# EAGLE board ArduinoZeroV4.0 (EAGLE 9.5.1)
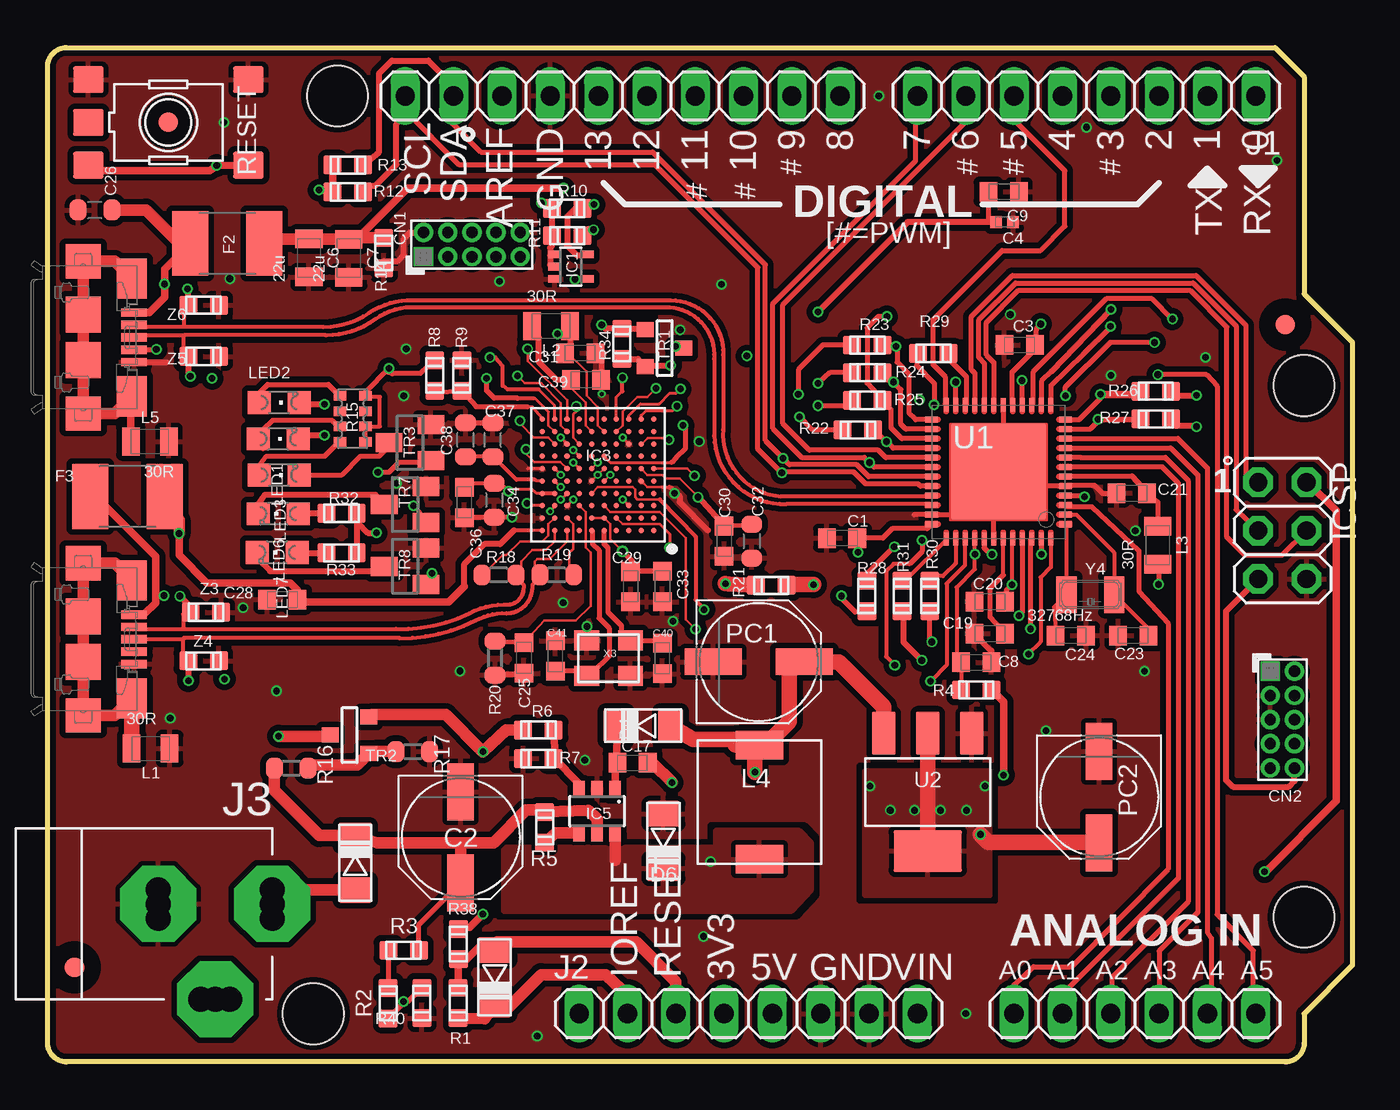
[diagram p3: board, top side]
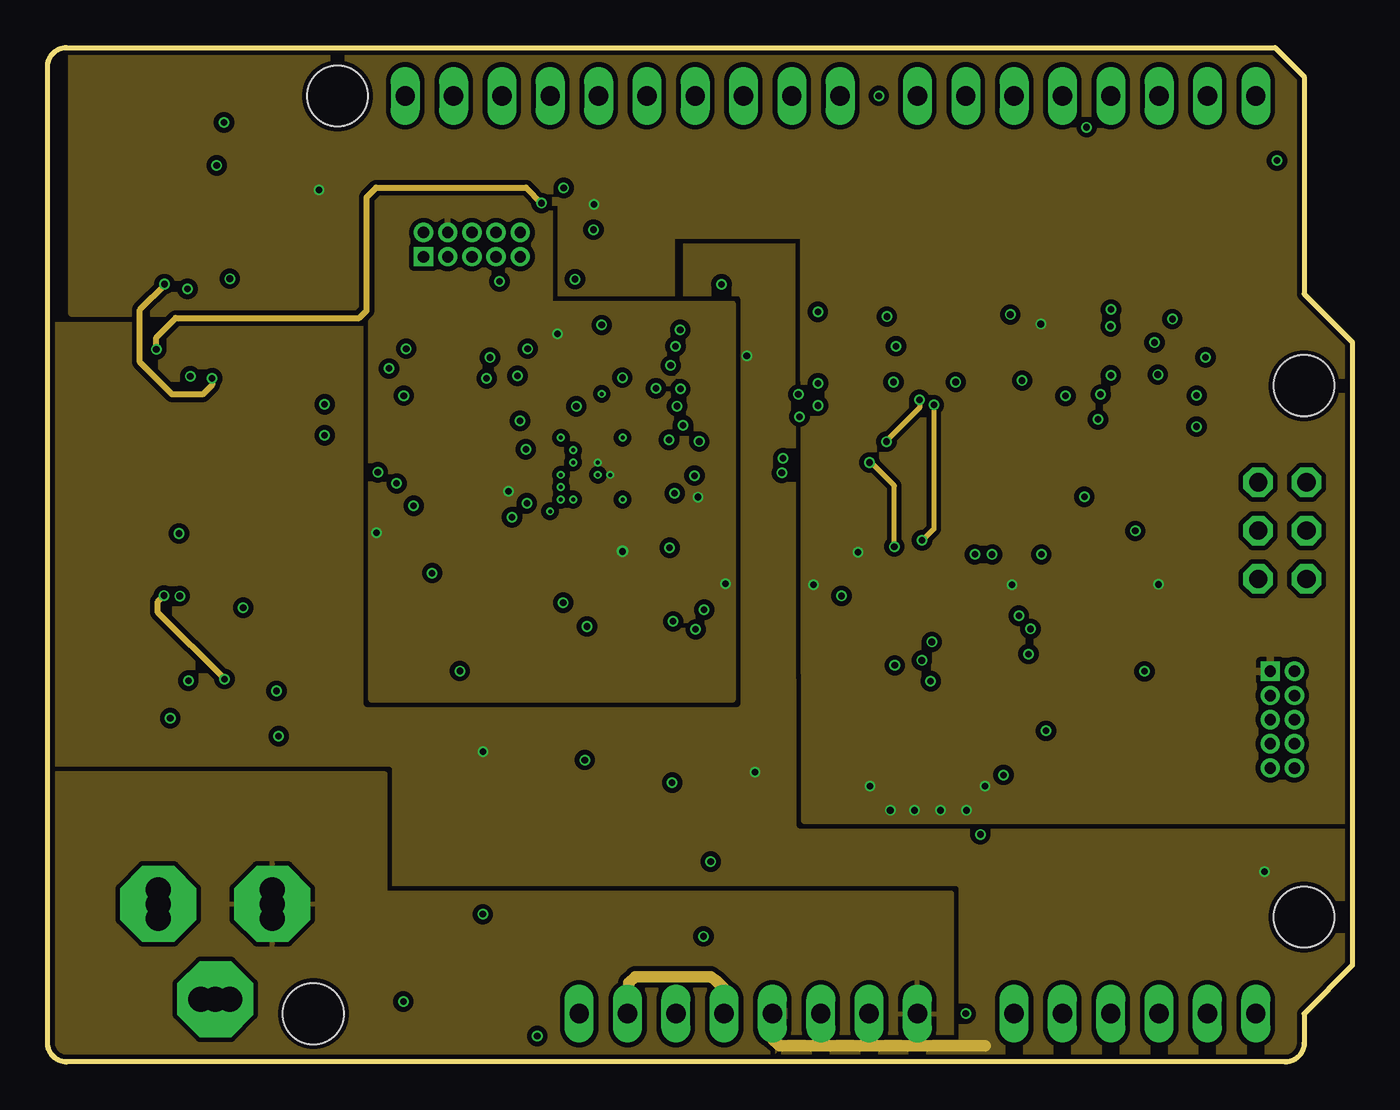
[diagram p4: board, inner layer Route2]
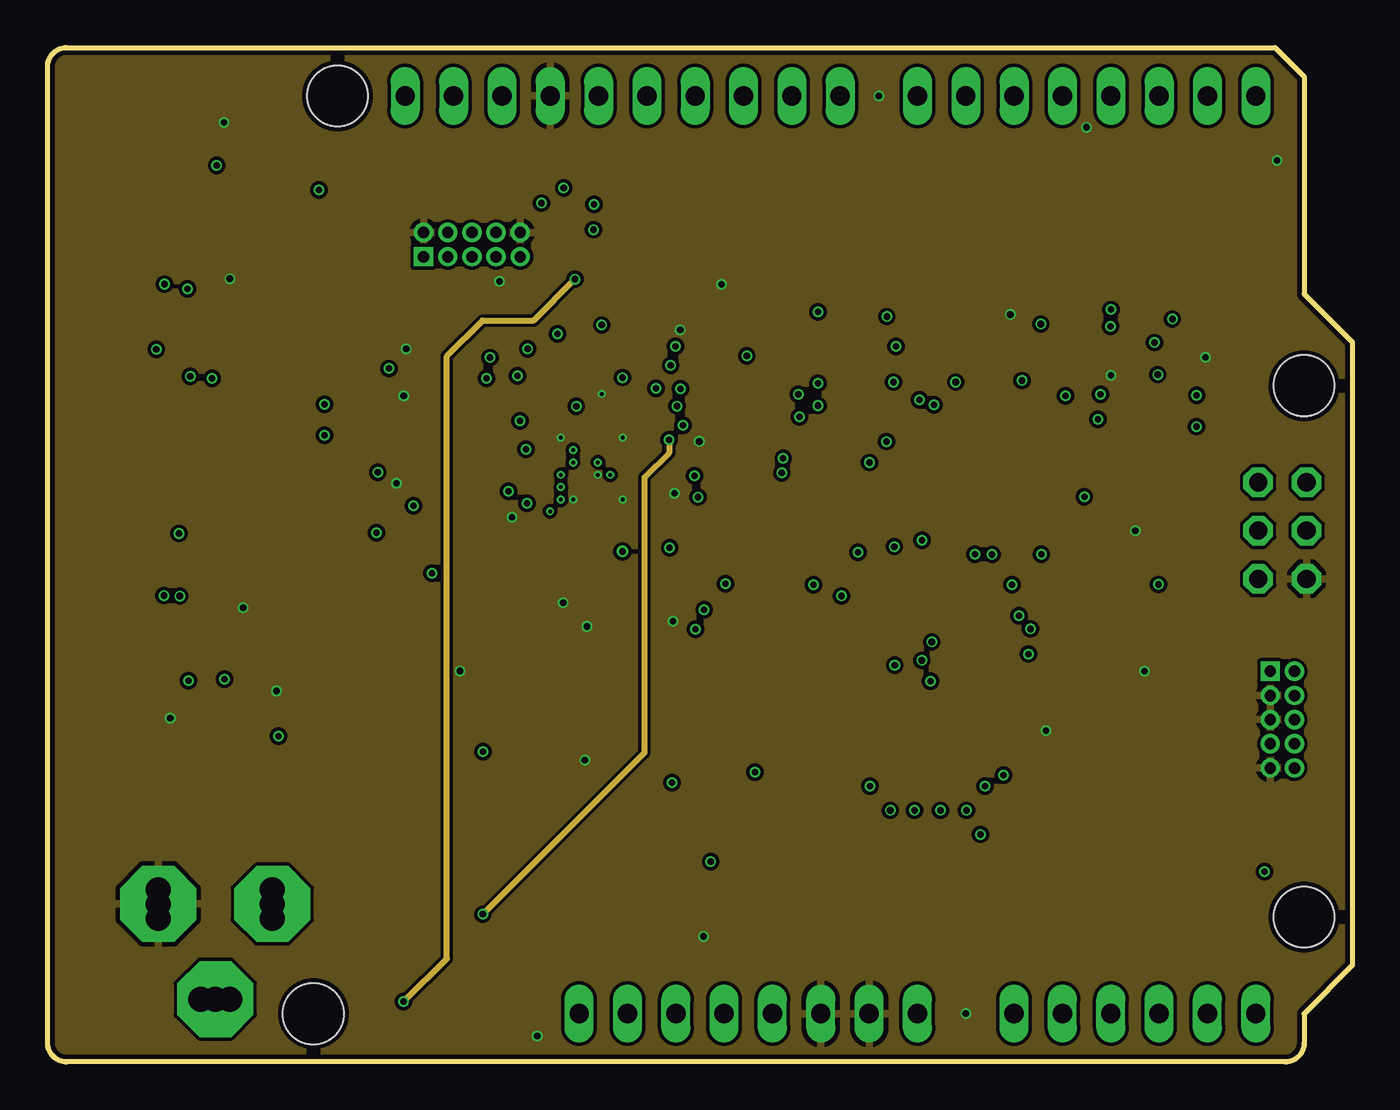
[diagram p5: board, inner layer Route15]
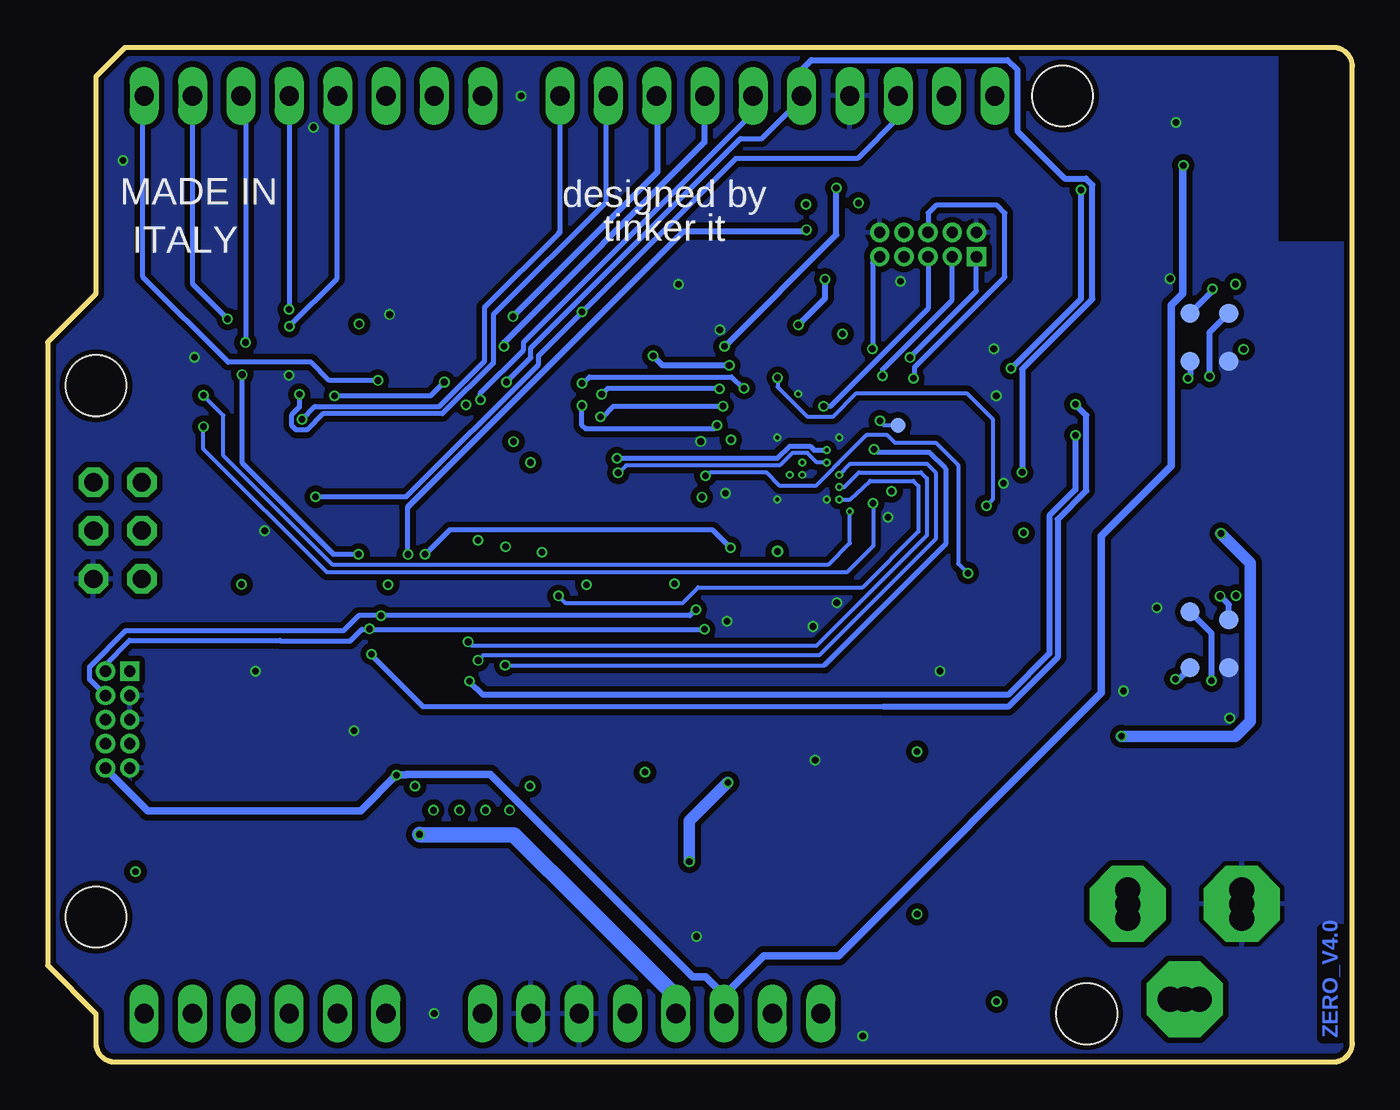
[diagram p6: board, bottom side, seen from below]

Size 68.58 x 53.34 mm. Coordinates in mm from the lower left corner, seen from the top.
Outline: 64.52,53.34 66.04,51.82 66.04,40.39 68.58,37.85 68.58,5.08 66.04,2.54 66.04,1 arc-90 65.04,0 1,0 arc-90 0,1 0,52.34 arc-90 1,53.34 64.52,53.34
Copper layers (1*2*15*16): Top 0.035mm / dielectric 0.2mm / Route2 0.0175mm / dielectric 0.3mm / Route15 0.0175mm / dielectric 0.2mm / Bottom 0.035mm
Design rules "B&B_4layers *": minimum track width 0.126mm, minimum drill 0.199mm, track to track 5mil, track to pad 5mil, pad to pad 3mil, via to via 3mil, smd to smd 0mil, copper to edge 10mil, drill to drill 8mil, minimum pad ring 6mil, minimum via ring 4mil, stop-mask expansion 4mil, vias tented up to drill 25mil, thermal gap 10mil
Net classes: 0 default: width 0.127 mm, drill 0.2 mm, clearance 0.076 mm; 1 USB: width 0.127 mm, drill 0.2 mm, clearance 0.178 mm; 2 gnd: width 0.127 mm, drill 0.2 mm, clearance 0.178 mm; 3 usbvcc: width 0.127 mm, drill 0.2 mm, clearance 0.178 mm; 4 USBpair: width 0.127 mm, drill 0.2 mm, clearance 0.076 mm to class 0
Holes 3.2 mm at 66.04,35.56 66.04,7.62 15.24,50.8 13.97,2.54

## Footprints (pad centres in the part's own frame; a part is rotated, then mirrored left to right if it is on the bottom)
TP-1.00MM = smd 1 x 1 bottom: X 0,0
0603-1608X90N = smd 0.95 x 1: 1 -0.8,0; 2 0.8,0
PANASONIC_D = smd 3 x 1.4: + 2.4,0; - -2.4,0
0402-1005X55N = smd 0.62 x 0.62: 1 -0.45,0; 2 0.45,0
0805-R2013X50N = smd 0.95 x 1.45: 1 -1,0; 2 1,0
C0603-ROUND = smd 0.898 x 1.1: 1 -0.889,0; 2 0.889,0
PINHEAD_2X05_127 = drill 0.6 pad 1.016 square: 1 -0.635,2.54 | drill 0.6 pad 1.016: 2 0.635,2.54; 3 -0.635,1.27; 4 0.635,1.27; 5 -0.635,0; 6 0.635,0; 7 -0.635,-1.27; 8 0.635,-1.27; 9 -0.635,-2.54; 10 0.635,-2.54
SOD123F = smd 1.34 x 1.8: A -1.43,0; C 1.43,0
L1812 = smd 1.9 x 3.4: 1 -1.95,0; 2 1.95,0
FD-1-1.5 = smd 1.016 x 1.016: P$1 0,0
SC70-5 = smd 0.4 x 0.7: 1 -0.65,-0.85; 2 0,-0.85; 3 0.65,-0.85; 4 0.65,0.85; 5 -0.65,0.85
VFBGA100 = smd 0.28 x 0.28: A1 -2.925,2.925; A2 -2.275,2.925; A3 -1.625,2.925; A4 -0.975,2.925; A5 -0.325,2.925; A6 0.325,2.925; A7 0.975,2.925; A8 1.625,2.925; A9 2.275,2.925; A10 2.925,2.925; B1 -2.925,2.275; B2 -2.275,2.275; B3 -1.625,2.275; B4 -0.975,2.275; B5 -0.325,2.275; B6 0.325,2.275; B7 0.975,2.275; B8 1.625,2.275; B9 2.275,2.275; B10 2.925,2.275; C1 -2.925,1.625; C2 -2.275,1.625; C3 -1.625,1.625; C4 -0.975,1.625; C5 -0.325,1.625; C6 0.325,1.625; C7 0.975,1.625; C8 1.625,1.625; C9 2.275,1.625; C10 2.925,1.625; D1 -2.925,0.975; D2 -2.275,0.975; D3 -1.625,0.975; D4 -0.975,0.975; D5 -0.325,0.975; D6 0.325,0.975; D7 0.975,0.975; D8 1.625,0.975; D9 2.275,0.975; D10 2.925,0.975; E1 -2.925,0.325; E2 -2.275,0.325; E3 -1.625,0.325; E4 -0.975,0.325; E5 -0.325,0.325; E6 0.325,0.325; E7 0.975,0.325; E8 1.625,0.325; E9 2.275,0.325; E10 2.925,0.325; F1 -2.925,-0.325; F2 -2.275,-0.325; F3 -1.625,-0.325; F4 -0.975,-0.325; F5 -0.325,-0.325; F6 0.325,-0.325; F7 0.975,-0.325; F8 1.625,-0.325; F9 2.275,-0.325; F10 2.925,-0.325; G1 -2.925,-0.975; G2 -2.275,-0.975; G3 -1.625,-0.975; G4 -0.975,-0.975; G5 -0.325,-0.975; G6 0.325,-0.975; G7 0.975,-0.975; G8 1.625,-0.975; G9 2.275,-0.975; G10 2.925,-0.975; H1 -2.925,-1.625; H2 -2.275,-1.625; H3 -1.625,-1.625; H4 -0.975,-1.625; H5 -0.325,-1.625; H6 0.325,-1.625; H7 0.975,-1.625; H8 1.625,-1.625; H9 2.275,-1.625; H10 2.925,-1.625; J1 -2.925,-2.275; J2 -2.275,-2.275; J3 -1.625,-2.275; J4 -0.975,-2.275; J5 -0.325,-2.275; J6 0.325,-2.275; J7 0.975,-2.275; J8 1.625,-2.275; J9 2.275,-2.275; J10 2.925,-2.275; K1 -2.925,-2.925; K2 -2.275,-2.925; K3 -1.625,-2.925; K4 -0.975,-2.925; K5 -0.325,-2.925; K6 0.325,-2.925; K7 0.975,-2.925; K8 1.625,-2.925; K9 2.275,-2.925; K10 2.925,-2.925
SOT23-6 = smd 0.6 x 0.9: 1 -0.95,-1.15; 2 0,-1.15; 3 0.95,-1.15; 4 0.95,1.15; 5 0,1.15; 6 -0.95,1.15
2X03 = drill 0.95 pad 1.55 octagon: 1 2.54,1.27; 2 2.54,-1.27; 3 0,1.27; 4 0,-1.27; 5 -2.54,1.27; 6 -2.54,-1.27
1X18-CUSTOM = drill 1.016 pad 1.27 long: 1 -17.78,0; 2 -15.24,0; 3 -12.7,0; 4 -10.16,0; 5 -7.62,0; 6 -5.08,0; 7 -2.54,0; 8 0,0; 9 4.064,0; 10 6.604,0; 11 9.144,0; 12 11.684,0; 13 14.224,0; 14 16.764,0; 15 19.304,0; 16 21.844,0; 17 24.384,0; 18 26.924,0
1X14-CUSTOM = drill 1.016 pad 1.27 long: 1 -17.78,0; 2 -15.24,0; 3 -12.7,0; 4 -10.16,0; 5 -7.62,0; 6 -5.08,0; 7 -2.54,0; 8 0,0; 9 5.08,0; 10 7.62,0; 11 10.16,0; 12 12.7,0; 13 15.24,0; 14 17.78,0
POWERSUPPLY_DC-21MM = drill 1.3 pad 4 octagon: +1 -0.076,-6.35; -1 -0.076,-0.356; E1 -5.08,-3.353 | drill 1.3: +2 -0.838,-6.35; +3 0.686,-6.35; -2 -0.838,-0.356; -3 0.686,-0.356; E2 -5.08,-2.591; E3 -5.08,-4.115
ZX62-AB-5PA = smd 0.4 x 1.35: 1 -1.3,3.025; 2 -0.65,3.025; 3 0,3.025; 4 0.65,3.025; 5 1.3,3.025 | smd 2.1 x 1.6: 6 3.1,2.9; 11 -3.1,2.9 | smd 1.8 x 1.9: 7 4,0.35; 10 -4,0.35 | smd 1.9 x 1.9: 8 1.2,0.35; 9 -1.2,0.35
SRR0604 = smd 1.5 x 2.5: P$1 3,0; P$2 -3,0
CHIPLED_0805 = smd 1.2 x 1.2: A -1.05,0; C 1.05,0
C0603 = smd 0.95 x 1: 1 -0.8,0; 2 0.8,0
CAY16 = smd 0.5 x 0.65: 1 -1.2,-0.675; 2 -0.4,-0.675; 3 0.4,-0.675; 4 1.2,-0.675; 5 1.2,0.675; 6 0.4,0.675; 7 -0.4,0.675; 8 -1.2,0.675
R0603-ROUND = smd 0.898 x 1.1: 1 -0.889,0; 2 0.889,0
TS42 = smd 1.6 x 1.4: 1 4.2,-2.25; 2 -4.2,-2.25; 3 4.2,2.25; 4 -4.2,2.25; 5 4.2,0
TP-SP = smd 0.8 x 0.8 bottom: X 0,0
SOT-23 = smd 0.787 x 0.889: 1 -0.025,1.016; 2 0.94,-1.016; 3 -0.991,-1.016
SOT23 = smd 1 x 1.4: 1 -0.95,-1.1; 2 0.95,-1.1; 3 0,1.1
QFN50P700X700X90-49XN-EPSQ515 = smd 0.65 x 0.28: 1 -3.525,2.75; 2 -3.525,2.25; 3 -3.525,1.75; 4 -3.525,1.25; 5 -3.525,0.75; 6 -3.525,0.25; 7 -3.525,-0.25; 8 -3.525,-0.75; 9 -3.525,-1.25; 10 -3.525,-1.75; 11 -3.525,-2.25; 12 -3.525,-2.75; 25 3.525,-2.75; 26 3.525,-2.25; 27 3.525,-1.75; 28 3.525,-1.25; 29 3.525,-0.75; 30 3.525,-0.25; 31 3.525,0.25; 32 3.525,0.75; 33 3.525,1.25; 34 3.525,1.75; 35 3.525,2.25; 36 3.525,2.75 | smd 0.28 x 0.65: 13 -2.75,-3.525; 14 -2.25,-3.525; 15 -1.75,-3.525; 16 -1.25,-3.525; 17 -0.75,-3.525; 18 -0.25,-3.525; 19 0.25,-3.525; 20 0.75,-3.525; 21 1.25,-3.525; 22 1.75,-3.525; 23 2.25,-3.525; 24 2.75,-3.525; 37 2.75,3.525; 38 2.25,3.525; 39 1.75,3.525; 40 1.25,3.525; 41 0.75,3.525; 42 0.25,3.525; 43 -0.25,3.525; 44 -0.75,3.525; 45 -1.25,3.525; 46 -1.75,3.525; 47 -2.25,3.525; 48 -2.75,3.525 | smd 5 x 5: 49 0,0
SOT223 = smd 2.235 x 1.219: 1 -3.099,2.311; 2 -3.099,0; 3 -3.099,-2.311 | smd 2.2 x 3.6: 4 3.099,0
CRYSTAL-3.2-2.5 = smd 1.3 x 1.05: 1 -1.15,-0.925; 2 1.15,-0.925; 3 1.15,0.925; 4 -1.15,0.925
ABS07 = smd 1.1 x 1.9: 1 -1.25,0; 2 1.25,0

## Placement (x,y rotation side)
BD+  DNP  [TP-1.00MM]  8.53,23.66 0 top
BD-  DNP  [TP-1.00MM]  6.5,23.27 0 top
C1  100n  [0603-1608X90N]  41.76,27.55 180 top
C2  47u  [PANASONIC_D]  21.71,11.81 270 top
C3  100n  [0603-1608X90N]  51.09,37.7 0 top
C4  100n  [0402-1005X55N]  50.3,44.16 0 top
C6  22u  [0805-R2013X50N]  13.74,42.27 270 top
C7  22u  [0805-R2013X50N]  15.83,42.26 270 top
C8  10n  [0603-1608X90N]  48.81,21.01 0 top
C9  4u7  [0603-1608X90N]  50.25,45.76 180 top
C17  10n  [0603-1608X90N]  30.74,15.73 0 top
C19  100n  [0603-1608X90N]  49.51,22.52 180 top
C20  100n  [0603-1608X90N]  49.51,24.2 180 top
C21  100n  [0603-1608X90N]  56.99,29.91 180 top
C23  22p  [0603-1608X90N]  57.07,22.42 0 top
C24  22p  [0603-1608X90N]  53.78,22.42 180 top
C25  10p  [0603-1608X90N]  25.04,21.23 270 top
C26  10n  [C0603-ROUND]  2.49,44.8 180 top
C28  100n  [0603-1608X90N]  12.33,24.31 180 top
C29  100n  [0603-1608X90N]  30.65,24.99 270 top
C30  100n  [0603-1608X90N]  35.56,27.38 270 top
C31  100n  [0603-1608X90N]  28,37.27 0 top
C32  1uF  [C0603-ROUND]  37.01,27.38 270 top
C33  1u  [0603-1608X90N]  32.31,25 270 top
C34  1uF  [C0603-ROUND]  23.47,29.54 270 top
C36  100n  [0603-1608X90N]  21.9,29.42 270 top
C37  10nF  [C0603-ROUND]  23.41,32.71 90 top
C38  1uF  [C0603-ROUND]  21.97,32.71 90 top
C39  100n  [0603-1608X90N]  28.3,35.86 0 top
C40  10p  [0603-1608X90N]  32.31,21.21 270 top
C41  10p  [0603-1608X90N]  26.69,21.35 90 top
CN1  -  [PINHEAD_2X05_127]  22.3,42.98 90 top
CN2  DNP  [PINHEAD_2X05_127]  64.9,18 0 top
D1  SS24FL  [SOD123F]  16.17,10.48 90 top
D2  SS24FL  [SOD123F]  23.5,4.46 270 top
D4  SS24FL  [SOD123F]  31.31,17.68 180 top
D6  SS24FL  [SOD123F]  32.36,11.62 270 top
D+  DNP  [TP-1.00MM]  6.5,39.37 0 top
D-  DNP  [TP-1.00MM]  8.53,39.37 0 top
F2  MF-MSMF050-2 500mA  [L1812]  9.45,43.04 180 top
F3  MF-MSMF050-2 500mA  [L1812]  4.2,29.73 180 top
FD1  DNP  [FD-1-1.5]  6.35,49.4 0 top
FD2  DNP  [FD-1-1.5]  1.42,4.98 0 top
FD3  DNP  [FD-1-1.5]  65.05,38.76 0 top
IC1  74LVC1G125DCKR  [SC70-5]  27.51,41.82 270 top
IC3  [VFBGA100]  28.93,30.88 180 top
IC5  LM2734Y  [SOT23-6]  28.88,13.19 180 top
ICSP  -  [2X03]  64.9,27.94 90 top
J1  -  [1X18-CUSTOM]  45.72,50.8 180 top
J2  -  [1X14-CUSTOM]  45.72,2.54 0 top
J3  -  [POWERSUPPLY_DC-21MM]  5.46,8.38 90 top
J4  -  [ZX62-AB-5PA]  1.52,38.1 270 top
J5  -  [ZX62-AB-5PA]  1.52,22.23 270 top
L1  30R  [0805-R2013X50N]  5.42,16.48 180 top
L2  30R  [0805-R2013X50N]  26.46,38.7 180 top
L3  30R  [0805-R2013X50N]  58.35,27.17 270 top
L4  10uH-SRR0604-100ML  [SRR0604]  37.41,13.66 270 top
L5  30R  [0805-R2013X50N]  5.38,32.62 0 top
LED1  YELLOW  [CHIPLED_0805]  12.12,32.77 0 top
LED2  YELLOW  [CHIPLED_0805]  12.17,34.67 0 top
LED3  YELLOW  [CHIPLED_0805]  12.17,30.86 0 top
LED6  YELLOW  [CHIPLED_0805]  12.12,28.83 180 top
LED7  YELLOW  [CHIPLED_0805]  12.07,26.8 180 top
PC1  47u  [PANASONIC_D]  37.38,21.04 0 top
PC2  47u  [PANASONIC_D]  55.26,13.93 270 top
R1  10k  [C0603]  21.58,3.1 270 top
R2  52k3  [C0603]  17.9,3.09 270 top
R3  52k3  [C0603]  18.71,5.87 180 top
R4  330R  [C0603]  48.81,19.56 0 top
R5  52k3  [C0603]  26.13,12.34 270 top
R6  52k3  [C0603]  25.8,17.46 0 top
R7  10k  [C0603]  25.79,15.95 180 top
R8  52k3  [C0603]  20.35,36.1 90 top
R9  52k3  [C0603]  21.77,36.1 270 top
R10  10k  [C0603]  27.3,44.88 0 top
R11  330R  [C0603]  27.31,43.45 0 top
R12  10k  [C0603]  15.79,45.75 180 top
R13  10k  [C0603]  15.79,47.16 180 top
R14  10k  [C0603]  17.67,42.54 90 top
R15  470R  [CAY16]  16.04,33.82 270 top
R16  52K3  [R0603-ROUND]  12.81,15.45 180 top
R17  52K3  [R0603-ROUND]  19.19,16.32 180 top
R18  39R  [R0603-ROUND]  23.72,25.61 180 top
R19  39R  [R0603-ROUND]  26.77,25.61 0 top
R20  6K8  [R0603-ROUND]  23.52,21.23 90 top
R21  0R  [C0603]  38.03,25.06 180 top
R22  330R  [C0603]  42.59,33.23 0 top
R23  330R  [C0603]  43.09,37.7 0 top
R24  330R  [C0603]  43.09,36.24 0 top
R25  330R  [C0603]  43.09,34.79 0 top
R26  330R  [C0603]  58.24,35.27 0 top
R27  330R  [C0603]  58.24,33.81 0 top
R28  330R  [C0603]  43.06,24.5 270 top
R29  330R  [C0603]  46.56,37.26 180 top
R30  330R  [C0603]  46.37,24.5 270 top
R31  330R  [C0603]  44.91,24.5 270 top
R32  330R  [C0603]  15.45,28.85 0 top
R33  330R  [C0603]  15.45,26.77 0 top
R34  10k  [C0603]  30.18,37.76 270 top
R38  330R  [C0603]  21.59,6.2 270 top
R40  52k3  [C0603]  19.67,3.1 90 top
RESET  -  [TS42]  6.35,49.4 180 top
TP_EDBG_FORCE_BOOT  TP_SP  [TP-SP]  23.88,33.49 0 top
TP_GND  TP_SP  [TP-SP]  26.41,50.8 0 top
TR1  PMV48XP  [SOT-23]  32.43,37.51 270 top
TR2  PMV48XP  [SOT-23]  15.87,17.21 90 top
TR3  2N7002  [SOT23]  19.05,32.56 90 top
TR7  2N7002  [SOT23]  18.8,29.32 90 top
TR8  2N7002  [SOT23]  18.8,26.07 90 top
U1  D21G18  [QFN50P700X700X90-49XN-EPSQ515]  49.98,31.03 180 top
U2  -  [SOT223]  46.26,14.19 270 top
U5V1  DNP  [TP-1.00MM]  8.53,20.73 0 top
U5V2  DNP  [TP-1.00MM]  8.53,36.83 0 top
U$4  DNP  [FRAME]  0,0 0 top
U$5  DNP  [FRAME]  0,0 0 top
U$6  DNP  [FRAME]  0,0 0 top
UGND1  DNP  [TP-1.00MM]  6.5,20.73 0 top
UGND2  DNP  [TP-1.00MM]  6.5,36.83 0 top
X3  12mHz-12pF-K7  [CRYSTAL-3.2-2.5]  29.48,21.23 0 top
Y4  32768Hz  [ABS07]  54.81,24.58 0 top
Z3  -  [C0603]  8.32,23.65 180 top
Z4  -  [C0603]  8.2,21.09 180 top
Z5  -  [C0603]  8.2,37.1 0 top
Z6  -  [C0603]  8.2,39.79 0 top

## Tracks (layer width: path | path; a pad name or v marks a point on that pad's centre or on a via)
+3V3  (via drill 0.35)
  Top 0.203: R15.5 R15.6 17.47,33.42 17.47,34.97 16.76,34.97 R15.8 | U1.44 50.69,27.46 v50.69,25.1
  Top 0.254: R8.2 19.6,36.2 18.14,36.2 | R15.8 16.71,35.23 v17.94,36.47 | U1.17 50.68,34.6 50.68,36.25 51.94,37.51 | U1.36 46.23,28.05 44.41,28.05 43.91,27.55 42.86,27.55 | C1.1 42.6,27.51 v42.6,26.8 | C3.2 51.98,38.58 v52.2,38.8 | C20.1 50.41,24.82 v50.69,25.1 | L3.2 58.4,26.12 58.4,25.11 v58.38,25.11
  Top 0.305: 42.86,27.55 C1.1 | 17.94,36.34 18.14,36.2 | 51.94,37.51 C3.2 | IC1.5 28.35,42.42 27.82,42.42 27.31,42.92 27.31,44.45 27.75,44.88 R10.2 28.64,45.02 arc-90 28.7,45.09 v28.72,45.09
  Top 0.406: R13.2 14.99,45.83 R12.2 14.77,45.85 v14.27,45.85 | 17.94,36.34 v17.94,36.47
  Top 0.61: J2.2 30.55,2.61 30.55,3.44 29.34,4.58 25.95,4.58 24.21,2.85 23.58,2.85 D2.C 22.99,2.28 R1.2
  Top 0.813: v40.26,25.1 38.95,25.1 R21.1 | PC2.+ 55.26,11.55 49.45,11.55 v49.03,11.97 | U2.4 U2.2
  Route2 0.61: J2.2 30.55,2.61 30.55,4.16 30.88,4.49 34.85,4.49 35.11,4.28 35.55,3.83 J2.4
  Bottom 0.254: 43.18,10.79 43.18,11.05
  Bottom 0.305: v17.94,36.47 14.27,40.14 v14.27,45.85
  Bottom 0.813: J2.4 35.55,3.44 42.15,10.04 42.17,10.04 43.18,11.05 44.07,11.94 49,11.94 v49.03,11.97
  other vias: 43.22,14.5 44.29,13.23 45.56,13.23 46.93,13.23 48.3,13.23 49.27,14.5
  pour Route2 (isolate 0.254, rank 2): 68.58,53.34 1.27,53.34 1.27,39.37 32.77,39.37 32.77,43.48 39.74,43.48 39.8,12.7 68.58,12.7
  pour Top: 49.53,15.32 49.53,8.74 42.96,8.74 42.96,15.32
+5V  (via drill 0.35)
  Top 0.305: R34.2 31.02,36.96 TR1.2 31.47,36.62 v32.75,36.62
  Top 0.406: ICSP.2 66.24,30.48 67.73,28.99 67.73,13.72 64.03,10.01 v63.96,10.01
  Top 0.61: R6.1 24.11,17.46 v22.88,16.32 20.93,18.27 17.05,18.27 16.91,18.12 TR2.2
  Top 0.813: v37.18,15.23 37.18,16.66 L4.P$2 36.14,16.66 36.45,16.97 | 36.45,16.97 33.94,16.97 D4.A | 36.45,16.97 36.5,17.02 38.1,17.02 38.99,17.91 38.99,20.7 39.33,21.04 PC1.+ 41.57,21.04 43.94,18.67 U2.3
  Route2 0.61: J2.5 38.1,1.23 38.48,0.84 49.27,0.84
  Bottom 0.305: v32.75,36.62 36.25,36.62 v36.75,37.12
  pour Route2 (isolate 0.254, rank 4): 0,38.61 33.69,38.61 33.69,43.86 40.21,43.86 40.21,38.64 68.58,38.64 68.58,0 0,0
BD+  (via drill 0.35)
  Top 0.127: IC3.A8 27.3,27.36 26.39,26.45 25.74,26.45 25.61,26.32 25.61,25.88
  Top 0.2: 18.49,22.28 arc-90 18.51,22.3 7.14,22.3 7.14,22.23 | 7.14,22.23 J5.3 | Z4.2 arc-90 7.14,21.17 7.14,22.23
  Top 0.203: 25.61,25.88 R19.1 25.88,25.56 25.48,25.09 25.48,24.89 arc-88 24.11,23.59 arc33 22.49,23.2 arc-26 18.49,22.28
  Top 0.305: Z4.2 v7.4,20.05
  Bottom 0.305: v7.4,20.05 7.4,22.54 BD+.X
BD-  (via drill 0.35)
  Top 0.127: IC3.A9 26.65,27.36 26.2,26.91 25.48,26.91 24.89,26.32 24.89,25.9
  Top 0.2: J5.2 arc90 4.65,22.77 7.12,22.77 | 7.12,22.77 18.32,22.77 | Z3.2 arc90 7.12,23.53 7.12,22.77
  Top 0.203: 24.89,25.9 R18.1 24.61,25.51 25.02,25.09 25.02,24.89 arc-94 24.05,24.05 arc0 23.98,24.05 arc29 22.16,23.59 arc-28 18.32,22.77
  Top 0.305: v6.95,24.5 7.53,23.93 Z3.2
  Bottom 0.305: BD-.X 6.5,24.05 v6.95,24.5
BOOST
  Top 0.406: IC5.1 29.83,15.72 C17.1 29.92,15.75 29.93,17.62 D4.C
DGI_GPIO0
  Top 0.254: R29.1 47.42,36.91 48.29,36.04 48.29,34.61 U1.22
DGI_GPIO1  (via drill 0.35)
  Top 0.254: J1.8 45.63,50.71 45.62,50.24 45.62,47.38 38.12,39.88 38.12,33.31 39.64,31.79 42.92,31.79 v43.2,31.52 43.44,31.28 U1.30 | R28.1 43.06,25.66 v44.5,27.1
  Route2 0.254: v44.5,27.1 44.5,30.3 43.28,31.52 v43.2,31.52
DGI_GPIO2  (via drill 0.35 pad 0.41)
  Top 0.254: U1.11 54.8,33.28 55.2,33.69 v55.2,33.78 | v55.2,33.78 57.33,33.78 R27.1 55.23,33.81 v55.2,33.78
  Bottom 0.254: J1.9 41.66,43.62 | v55.2,33.78 54.52,34.47 47.98,34.47 45.6,36.84 45.6,39.69 41.7,43.59
  Bottom 0.305: 41.7,43.59 41.66,43.62
DGI_GPIO3  (via drill 0.35 pad 0.41)
  Top 0.254: U1.12 54.22,33.78 55.34,34.91 v55.34,35.1
  Top 0.406: R26.1 57.1,35.1 v55.34,35.1
  Bottom 0.254: J1.10 39.23,50.69 39.23,45.22 45.14,39.31 45.14,36.77 47.83,34.08 54.11,34.08 54.96,33.24 55.52,33.24 55.74,33.46 55.74,34.03 55.34,34.42 v55.34,35.1
EDBG_ADC0
  Top 0.152: 25.22,34.45 25.48,34.45 26,33.87 IC3.K10
  Top 0.254: 25.22,34.45 22.52,34.45 R9.2 20.37,35.2 R8.1
EDBG_FORCE_BOOT  (via drill 0.35)
  Top 0.127: IC3.H9 26.32,32.83 25.56,32.83 24.83,33.56 v24.83,33.71
  Bottom 0.203: v24.83,33.71 24.61,33.49 TP_EDBG_FORCE_BOOT.X
EN
  Top 0.61: R5.2 26.71,12.04 IC5.4
FB
  Top 0.406: IC5.3 27.93,14.66 26.64,15.95 R7.1 26.69,15.96 R6.2
GND  (via drill 0.2, 0.21, 0.21 pad 0.41, 0.35)
  Top 0.127: IC3.E6 v28.93,30.88 IC3.F5 | IC3.C3 v30.23,29.57 | IC3.E2 31.52,30.23 32.3,30.23
  Top 0.152: IC3.H8 v26.98,32.83 | IC3.H3 v30.23,32.83 | IC3.F10 25.22,31.2 | 32.3,30.23 32.7,30.23 | IC3.C8 v27.62,29.57
  Top 0.254: C37.2 C38.2 | C36.2 23.44,28.62 C34.2 24.26,28.67 v24.41,28.64 | C21.2 56.09,29.9 55.45,29.9 55.03,30.31 53.54,30.31 U1.5 51.23,30.28 50.23,31.28 | 32.7,30.23 33.02,29.9 v32.96,29.9 | U1.18 50.23,31.28 | 50.23,31.28 U1.49 49.73,30.78 49.73,28.74 | U1.42 49.73,28.74 | 49.73,28.74 49.69,28.78 U1.35 45.55,28.78
  Top 0.305: R14.1 17.69,42.12 18.39,42.12 18.72,42.45 18.72,43.29 19.04,43.61 CN1.2 | R20.1 C25.2 | v32.96,29.9 33.22,29.77 33.22,29.45 34.71,27.95 | C19.2 49.61,21.62 C8.2 | C31.2 29.1,36.97 C39.2 | J4.5 6.25,36.8
  Top 0.406: 17.61,42.04 R14.1
  Bottom 0.406: v18.85,37.51 18.79,37.44
  other vias: 34.47,6.6 6.45,18.07 54.61,49.15 43.69,50.8 48.26,2.54 25.74,1.36 64.62,47.4 9.27,49.4 12.03,19.51 35.42,40.88 18.72,35.03 57.17,27.93 21.67,20.56 57.66,20.54 52.47,17.41 28.24,15.88 32.88,23.17 9.58,41.19 50.6,39.3 27.1,24.15 23.75,41.05 60.86,37.05 28.35,22.9 34.25,32.62 10.28,23.89 33.25,38.5 29.12,35.12 55.88,36.1 18.34,30.42
  pour Bottom (isolate 0.305, rank 2): 3.98,53.35 68.58,53.35 68.58,0 3.35,0 3.4,0.05 0,0.05 0,43 0.03,43.02 3.98,43.02
  pour Top (isolate 0.305, rank 2): 0,53.34 68.58,53.34 68.58,0 0,0
  pour Route15: 0,0 68.58,0 68.58,53.34 0,53.34
N$1
  Top 0.305: LED6.C 11.07,29.32 11.44,29.84 17.23,29.84 TR7.3
N$2
  Top 0.305: LED7.C 11.02,26.49 11.7,25.8 17.54,25.8 TR8.3
N$3
  Top 0.254: LED3.C 13.29,30.88 15.47,30.88 16.45,31.85 17.42,31.85 18.03,32.46 TR3.3
N$4  (via drill 0.35)
  Top 0.254: 27.72,41.17 v27.72,41.16 | R2.2 18.82,3.21 18.98,3.21 | v18.7,3.18 18.95,3.18 18.98,3.21 | R40.2 18.98,3.21
  Top 0.305: TR1.3 31.36,38.56 R34.1 29.31,38.56 v29.12,38.75 | IC1.4 27.72,41.17
  Route15 0.305: v18.7,3.18 18.73,3.18 20.98,5.44 20.98,37.11 22.86,38.99 25.55,38.99 v27.72,41.16
  Bottom 0.305: v29.12,38.75 27.72,40.16 v27.72,41.16
N$5
  Top 0.254: R3.2 R2.1
N$6
  Top 0.61: J5.6 3.52,18.23 J5.7 J5.8 J5.9 J5.10 3.52,26.23 J5.11
  Top 0.813: J5.6 L1.2
N$7  (via drill 0.35)
  Top 0.254: J4.4 arc-90 4.56,37.47 v5.71,37.47
  Top 0.305: 26.42,42.42 26.42,42.8 26.51,42.92 R11.1 R10.1 26.13,45.16 v25.96,45.16 | 26.42,42.42 26.42,41.91 26.52,41.8 IC1.2 | IC1.1 26.65,42.42 26.42,42.42
  Route2 0.305: v5.71,37.47 5.71,38.1 6.73,39.12 16.38,39.12 16.76,39.5 16.76,45.47 17.27,45.97 25.15,45.97 v25.96,45.16
N$10
  Top 0.254: C21.1 58.32,29.46 58.35,29.43 L3.1 | 57,30.79 53.51,30.79 U1.6
  Top 0.305: C21.1 57,30.79
N$15
  Top 0.406: L5.1 4.38,34.95 J4.6
  Top 0.61: J4.11 3.52,42.1 J4.10 J4.9 J4.8 J4.7 3.52,34.1 J4.6
N$16
  Top 0.61: R17.2 17.21,16.32 17.11,16.22 TR2.3 16.29,15.62 13.89,15.62 R16.1
N$18
  Top 0.127: IC3.B9 26.32,28.27 26.32,27.69 26,27.36 24.83,27.36 24.11,26.65 23.92,26.65 22.88,25.61
  Top 0.203: 22.88,25.61 R18.2
N$19
  Top 0.127: IC3.B8 27.62,28.27 27.62,26.98 27.43,26.78 27.43,25.84
  Top 0.203: 27.43,25.84 R19.2
N$20
  Top 0.254: LED1.A 11.31,32.25 11.31,33.22 11.83,33.73 14.95,33.73 15.27,33.42 R15.3
N$21
  Top 0.254: LED2.A 11.12,35.17 11.57,35.62 14.76,35.62 R15.1
N$22
  Top 0.254: LED3.A 11.12,31.36 11.51,31.85 14.56,31.85 15.33,32.62 R15.4
N$23
  Top 0.127: IC3.C7 28.27,28.93 28.27,27.04 28.54,26.78 28.54,23.98 27.75,23.2 26.12,23.2 C25.1
  Top 0.254: C25.1 R20.2
N$24
  Top 0.254: IC3.A6 28.64,27.91 28.64,27.26 28.99,26.91 28.99,23.34 29.51,22.82 29.51,21.32 28.66,20.48 28.24,20.48 X3.1 28.09,20.55 C41.1
N$25
  Top 0.254: IC3.A5 29.25,27.23 29.45,27.04 29.45,23.66 30.16,22.95 30.16,22.63 X3.3 32.23,22.16 C40.1
N$26
  Top 0.152: IC3.E10 25.68,30.55 25.61,30.61
  Top 0.203: C38.1 C37.1 23.43,31.82 24.64,30.61 25.61,30.61
N$27
  Top 0.127: IC3.J6 28.27,33.48 28.27,34.67 27.5,35.45 C39.1
  Top 0.305: C39.1 26.75,35.86 25.82,36.79 25.82,38.09 25.46,38.45 L2.2
N$34  (via drill 0.35)
  Top 0.152: IC3.K2 31.2,33.99 31.46,34.26 32.86,34.26 v33.09,34.48 v33.09,34.49
  Top 0.254: R22.1 40.22,33.23 v39.52,33.93
  Bottom 0.254: v33.09,34.49 38.86,34.49 39.45,33.87 v39.52,33.93
N$37  (via drill 0.35)
  Top 0.152: IC3.K3 30.55,33.99 31.16,34.61 32.14,34.61 32.7,35.16 33.02,35.16 33.26,35.41 v33.26,35.39
  Top 0.254: R23.1 40.75,37.7 39.45,36.4 v39.45,35.1
  Bottom 0.254: v33.26,35.39 33.3,35.42 39.13,35.42 v39.45,35.1
N$38  (via drill 0.35)
  Top 0.127: IC3.J4 30.23,33.48 30.23,34.19 31,34.97 31.52,34.97 v31.98,35.42
  Top 0.254: R24.1 41.12,36.24 v40.49,35.69
  Bottom 0.254: v40.49,35.69 40.43,35.69 40.09,36.02 32.63,36.02 32.03,35.42 v31.98,35.42
N$39  (via drill 0.35)
  Top 0.152: IC3.G5 29.25,31.84 29.56,31.52 32.79,31.52
  Top 0.254: v40.49,34.52 41.95,34.52 R25.1 | 32.79,31.52 33.02,31.75 33.53,32.26 33.53,33.34 v33.4,33.47
  Bottom 0.254: v33.4,33.47 33.59,33.28 40.3,33.28 40.49,33.48 v40.49,34.52
N$40  (via drill 0.21, 0.35)
  Top 0.152: IC3.C9 26.65,29.2 v26.41,28.95
  Top 0.305: R26.2 59.09,35.31 59.09,35.16 59.22,35.03 60.38,35.03 v60.39,35.05
  Bottom 0.203: v26.41,28.95 26.41,27.28 27.53,26.16 53.62,26.16 59.34,31.88 59.34,34 v60.39,35.05
N$41  (via drill 0.35)
  Top 0.152: IC3.C10 25.32,29.25 v25.19,29.38
  Top 0.203: 59.11,33.87 R27.2
  Top 0.305: 59.11,33.87 59.11,33.52 59.15,33.48 60.32,33.48 v60.38,33.41
  Bottom 0.203: v25.19,29.38 25.19,27.14 26.59,25.74 53.88,25.74 60.38,32.24 v60.38,33.41
N$42  (via drill 0.21 pad 0.41, 0.35)
  Top 0.152: v26.98,29.57 IC3.D8
  Top 0.254: R28.2 43.01,23.66 42.45,23.66 41.73,24.38 v41.73,24.5
  Bottom 0.203: v41.73,24.5 41.34,24.11 35.23,24.11 34.38,24.96 25.74,24.96 22.82,27.89 22.82,30.29 23.07,30.55 25.35,30.55 26.39,29.57 v26.98,29.57
N$43  (via drill 0.35)
  Top 0.127: IC3.F8 26.95,31.55 25.59,31.55 25.14,32 v25.14,32.21
  Top 0.203: 45.3,26.2 44.46,26.2 44.07,25.8 44.07,21.31 v44.52,20.86
  Top 0.254: R29.2 45.67,36.62 46.61,35.68 46.61,34.58 v46.58,34.55 | v45.96,27.43 45.96,26.85 45.3,26.2
  Route2 0.254: v46.58,34.55 46.58,28.02 45.98,27.42 v45.97,27.42 v45.96,27.43
  Bottom 0.203: v44.52,20.86 27.76,20.86
  Bottom 0.254: 27.76,20.86 21.39,27.23 21.39,31.2 22.23,32.05 24.97,32.05 v25.14,32.21
N$44  (via drill 0.21, 0.35)
  Top 0.152: IC3.E9 v26.98,30.23
  Top 0.254: R30.2 46.34,23.59 46.34,21.96 46.41,22.09 v46.47,22.09
  Bottom 0.203: v26.98,30.23 26.71,30.23 25.93,31 22.68,31 22.36,30.68 22.36,27.69 28.15,21.9 46.28,21.9 v46.47,22.09
N$45  (via drill 0.21, 0.35)
  Top 0.152: IC3.F9 v26.98,30.88
  Top 0.254: R31.2 44.98,23.55
  Top 0.305: 44.98,23.55 44.98,22.08 v45.95,21.12
  Bottom 0.203: v26.98,30.88 26.39,31.46 22.36,31.46 21.91,31 21.91,27.5 27.89,21.51 28.03,21.38 45.68,21.38 v45.95,21.12
N$57  (via drill 0.35)
  Top 0.152: IC3.K9 26.65,34.52 25.8,35.36
  Top 0.203: 25.8,35.36 24.18,35.36 23.92,35.55 23.92,36.59 23.54,37.04 v23.25,37.04
  Bottom 0.152: CN1.1
  Bottom 0.254: v23.25,37.04 v23.25,37.05 19.76,40.54 CN1.1
N$58  (via drill 0.35)
  Top 0.127: v25.23,37.51 25.23,36.86 27.3,34.8 IC3.K8
  Bottom 0.254: CN1.9 24.9,42.34 25.22,42.03 25.2,37.54 v25.23,37.51
N$59  (via drill 0.35)
  Top 0.127: IC3.J8 26.98,33.48 26.98,34.65 25.94,35.69 25.09,35.69 v24.7,36.08
  Top 0.152: IC3.J8 27.3,33.22 27.23,33.22 IC3.J8
  Bottom 0.152: 21,42.31 CN1.3
  Bottom 0.203: 21,42.31 21.06,42.24
  Bottom 0.254: 21.06,42.24 21.06,40.02 24.7,36.38 v24.7,36.08
N$60  (via drill 0.35)
  Top 0.127: IC3.H7 27.62,32.83 27.62,34.06 27.77,34.21 v27.79,34.48
  Bottom 0.152: CN1.5
  Bottom 0.254: CN1.5 22.3,39.62 27.43,34.48 v27.79,34.48
N$61  (via drill 0.35)
  Top 0.127: IC3.J9 26.32,33.48 26.32,34.19
  Top 0.152: 25.55,34.91 25.61,34.91 26.32,34.19
  Top 0.203: 24.7,34.91 25.55,34.91
  Top 0.254: 24.7,34.91 23.46,34.91 23.07,35.3 v23.07,35.95
  Bottom 0.254: CN1.6 22.3,44.63 21.89,45.05 18.68,45.05 18.27,44.63 18.27,41.27 23.02,36.51 23.02,35.99 v23.07,35.95
N$67
  Top 0.305: LED6.A 13.19,28.85 R32.1
N$68
  Top 0.305: LED7.A 13.14,26.77 R33.1
PA00_XIN32
  Top 0.203: U1.1 53.56,28.22 Y4.1 52.9,23.92 C24.2
PA01_XOUT32
  Top 0.203: U1.2 54.06,28.78 56.06,26.78 Y4.2 57.92,22.72 C23.2
PA02_AIN0
  Top 0.254: J2.9 50.8,4.07 51.8,5 53.82,5 58.89,10.14 58.89,23.07 57.35,24.75 57.35,26.88 54.89,29.19 53.59,29.19 U1.3
PA03_AREFA  (via drill 0.35)
  Top 0.254: U1.4 54.48,29.78 54.49,29.79 v54.49,29.72 | C9.2 49.45,44.18 49.47,44.16
  Top 0.305: C4.1 49.47,44.16 45.21,44.16 v40.48,39.44
  Bottom 0.254: v54.49,29.72 49.72,29.72 42.77,36.67 42.77,37.15 v40.48,39.44 32.42,47.5 26.01,47.5 23.88,49.64 J1.16
PA04_AIN4
  Top 0.254: J2.12 58.42,5.84 60.45,7.87 60.45,30.86 59.03,32.29 59.02,32.28 U1.9
PA05_AIN5
  Top 0.254: J2.13 61.16,2.74 61.16,6.51 60.96,6.81 60.96,31.23 59.4,32.79 59.39,32.78 U1.10
PA08_TCC0-W0  (via drill 0.35 pad 0.41)
  Top 0.254: U1.13 52.74,35.58 54.47,37.24 55.87,38.65 v55.87,38.68
  Bottom 0.254: J1.5 53.39,50.75 53.39,41.16 v55.87,38.68
PA09_TCC0-W1  (via drill 0.35 pad 0.41)
  Top 0.254: 52.77,36.33 52.24,35.79 U1.14
  Top 0.305: 52.77,36.33 v55.89,39.56
  Bottom 0.254: J1.4 55.88,39.58 v55.89,39.56
PA10_TCC0-W2  (via drill 0.35 pad 0.41)
  Top 0.254: U1.15 51.79,34.61 51.79,36.27 55.65,40.13 58.05,40.13 v59.12,39.06
  Bottom 0.254: v59.12,39.06 60.95,40.9 60.95,50.78
  Bottom 0.305: 60.95,50.78 J1.2
PA11_TCC0-W3  (via drill 0.35)
  Top 0.254: U1.16 51.23,35.8 51.22,35.81 v51.22,35.83
  Bottom 0.254: v51.22,35.83 53.77,35.83 54.73,36.79 59.09,36.79 63.57,41.27 63.57,50.73 J1.1
PA12_S4_SPI_MISO
  Top 0.254: ICSP.1 62.98,30.49 62.98,38.74 60.37,41.36 50.71,41.36 48.55,39.2 48.55,36.4 48.74,36.22 U1.21
PA14_TCC0-W4  (via drill 0.35)
  Top 0.254: v53.49,35.02 53.49,35.49 55.84,37.84 v58.17,37.84 v58.17,37.83 | U1.23 47.73,35.71 v47.73,35.75
  Bottom 0.254: v47.73,35.75 48.46,35.02 v53.49,35.02 | J1.3 58.17,50.55 v58.17,37.83
PA15_TCC0-W5
  Top 0.254: U1.24 47.17,34.61 47.17,36.03 46.54,36.66 46.54,39.05 50.16,42.67 52.2,42.67 53.47,43.94 53.47,46.86 50.8,49.53 J1.6
PA16_MOSI  (via drill 0.35)
  Top 0.254: R23.2 44.4,37.7 v44.59,37.63 44.66,37.63 44.66,36.79 45.27,36.17 45.27,34.12 45.62,33.78 U1.25
  Bottom 0.305: J1.12 34.06,50.78 34.06,48.35 34.2,48.23 44.59,37.83 v44.59,37.63
PA17_SCK  (via drill 0.35)
  Top 0.254: v44.46,35.75 44.85,35.36 44.85,33.54 45.11,33.28 U1.26 | TR3.1 20.01,31.52 18.46,31.52 17.94,31 v17.36,31
  Top 0.305: R24.2 43.86,36.24 43.81,36.27 44.33,35.75 v44.46,35.75
  Bottom 0.254: v44.46,35.75 43.18,37.03 43.18,37.54 32.17,48.55 31.04,48.55 29.05,50.54 29.05,50.7
  Bottom 0.305: 29.05,50.7 J1.14 28.99,50.83 28.99,52.13 28.43,52.69 18.14,52.69 17.61,52.16 17.61,48.95 15.12,46.45 14.01,46.45 13.67,46.11 13.67,40.12 17.36,36.43 v17.36,31
PA19_MISO  (via drill 0.35)
  Top 0.254: U1.28 44.43,32.28 v44.09,32.62 R22.2
  Route2 0.254: v45.83,34.82 45.83,34.4 44.05,32.62 v44.09,32.62
  Bottom 0.254: v45.83,34.82 45.83,35.17 43.56,37.44 43.56,37.85 31.61,49.8
  Bottom 0.305: 31.61,49.8 31.5,49.91 J1.13
PA20_TCC0-W6
  Top 0.254: U1.29 44.06,31.78 43.66,32.17 40.04,32.17 38.64,33.57 38.64,39.81 48.26,49.43 J1.7
PA22_SDA  (via drill 0.21, 0.35)
  Top 0.152: IC3.G7 v27.62,32.17
  Top 0.254: J1.17 21.29,50.75 21.29,49.34 22.77,47.85 31.8,47.85 37.72,41.92 37.72,32.68 v38.66,31.74 38.99,31.41 42.52,31.41 43.16,30.78 U1.31
  Top 0.305: R13.1 17.42,47.85 17.42,51.98 18.09,52.66 20.02,52.66 21.34,51.33 J1.17
  Bottom 0.254: v38.66,31.74 v38.65,31.75 30.22,31.75 29.59,32.38 28.5,32.38 28.29,32.17 v27.62,32.17
PA23_SCL  (via drill 0.21, 0.35)
  Top 0.152: IC3.F7 v27.62,31.52
  Top 0.254: J1.18 18.8,50.01 21.61,47.19 31.91,47.19 37.34,41.77 37.34,32.23 v38.59,30.97 38.68,31.07 38.71,31.03 42.37,31.03 43,30.4 45.75,30.4 45.87,30.28 U1.32
  Top 0.305: R12.1 16.82,46.09 17.23,46.09 18.33,47.19 18.33,49.34 18.8,49.8 18.8,50.01
  Bottom 0.203: v27.62,31.52 28.14,31.52 28.65,32.03 29.44,32.03 30.1,31.37 38.18,31.37 38.57,30.97 v38.59,30.97
PA27_TX_LED  (via drill 0.35)
  Top 0.203: v46.41,20.02 47.26,20.86 47.26,25.16 48.23,26.13 48.23,26.76 U1.39
  Top 0.305: LED1.C 13.44,32.97 v14.56,32.95
  Bottom 0.305: v14.56,32.95 14.56,30.09 15.93,28.73 15.93,21.48 18.1,19.3 45.69,19.3 v46.41,20.02
PA28_USB_HOST_EN  (via drill 0.35)
  Top 0.254: U1.41 49.23,27.03 49.57,26.68 v49.65,26.68
  Top 0.406: R11.2 28.13,43.45 28.44,43.76 v28.69,43.76
  Bottom 0.254: v49.65,26.68 49.65,29.18
  Bottom 0.305: v28.69,43.76 28.74,43.68 35.14,43.68 49.65,29.18
PA30_SWCLK  (via drill 0.35)
  Top 0.127: IC3.D6 28.93,30.23 30.75,30.23 30.88,30.09 30.88,29.7 31,29.57 32.18,29.57
  Top 0.203: v34.51,23.78 34.06,24.3 34.06,27.63 32.18,29.57
  Top 0.254: U1.45 51.23,23.64 v51.05,23.46
  Bottom 0.254: CN2.4 66.38,20.11 66.38,20.78 64.47,22.68 53.01,22.68 52.23,23.46 v51.05,23.46 34.83,23.46 v34.51,23.78
PA31_SWDIO  (via drill 0.35)
  Top 0.127: IC3.C5 29.57,28.93 32.17,28.93 33.54,27.56 33.54,23.27 v34.06,22.75
  Top 0.254: U1.46 51.66,27.43 v51.66,22.77
  Bottom 0.254: 51.64,22.75 52.06,22.75 52.68,22.14 56.33,22.14 56.35,22.16 64.28,22.16 65.58,20.86 65.58,20.59 CN2.2 | v51.66,22.77 51.64,22.75 | 51.64,22.75 v34.06,22.75
PB02_AIN10  (via drill 0.35)
  Top 0.254: 63.38,2.67 63.38,5.85 61.47,7.76 61.47,35.54 60.91,36.14 v58.35,36.14 | U1.47 v52.23,26.69
  Top 0.305: J2.14 63.38,2.67
  Bottom 0.254: v52.23,26.69 53.54,26.69 58.34,31.49 58.34,36.15 v58.35,36.14
PB03_RX_LED  (via drill 0.35)
  Top 0.203: v51.55,21.45 52.2,22.09 52.2,25.48 52.74,26.02 U1.48
  Top 0.305: v14.56,34.58 13.26,34.58 LED2.C
  Bottom 0.254: 24.65,18.67 48.84,18.67 51.55,21.38
  Bottom 0.305: v14.56,34.58 13.98,34 13.98,30.05 15.49,28.54 15.49,21.28 18.1,18.67 24.65,18.67 | 51.55,21.38 v51.55,21.45
PB08_AIN2
  Top 0.254: J2.10 53.44,2.64 53.44,3.65 59.44,9.65 59.44,30.44 58.59,31.29 53.51,31.29 U1.7
PB09_AIN3
  Top 0.254: J2.11 55.93,2.59 55.93,4.42 59.94,8.43 59.94,30.59 58.74,31.79 54.29,31.79 54.27,31.79 U1.8
PB10_S4_SPI_MOSI
  Top 0.254: ICSP.4 64.88,26.65 62.92,26.65 61.98,27.59 61.98,38.64 60.05,40.57 51.03,40.57 49.34,38.88 49.34,37.18 49.74,36.78 U1.19
PB11_S4_SPI_SCK
  Top 0.254: ICSP.3 62.47,29.04 62.47,38.7 60.21,40.96 50.88,40.96 48.95,39.03 48.95,37.02 49.24,36.73 U1.20
PB22_TXD
  Top 0.203: R31.1 45.16,25.39 47.23,27.46 U1.37
PB23_RXD
  Top 0.203: R30.1 46.52,25.55 47.06,25.55 47.74,26.22 47.73,26.23 U1.38
POWER_LED_CTRL  (via drill 0.35)
  Top 0.152: IC3.K4 29.9,34.97 30.18,35.24
  Top 0.203: TR7.1 19.72,28.73 v19.24,29.25 | v30.21,35.98 30.21,35.27 30.18,35.24
  Bottom 0.203: v30.21,35.98 30.21,35.49 28.66,33.95 27.29,33.95 26.07,35.16 20.28,35.16 18.91,33.8 18.91,29.57 v19.24,29.25
PWRIN
  Top 0.254: J3.+1 J3.+3
  Top 0.61: D1.A 12.55,9.05 J3.+1
  pour Route2 (isolate 0.254, rank 3): 0,15.14 0,0 47.52,0 47.52,8.88 17.75,8.88 17.75,15.14
RESET  (via drill 0.35)
  Top 0.254: J2.3 33.02,3.51
  Top 0.305: ICSP.5 61.92,23.7 61.92,14.83 62.29,14.46 65.23,14.46 65.53,14.77 CN2.10
  Top 0.406: RESET.3 2.15,47.11 2.39,46.86 8.52,46.86 8.96,47.17 v8.89,47.14 RESET.4 | R1.1 21.58,5.32 R38.2 21.97,5.33 22.8,6.16 D2.A | R4.2 50.24,18.93 v50.24,15.09
  Top 0.61: 33.02,3.51 33.02,4.22 30.94,6.3 23.64,6.3 D2.A
  Bottom 0.254: 33.02,3.5 J2.3 33.02,3.51
  Bottom 0.406: 33.02,3.5 30.93,5.59 27.01,5.59 13.2,19.41 13.2,27.66 9.53,31.33 9.53,39.8 8.92,40.41 8.92,47.11 v8.89,47.14 | CN2.10 65.55,15.45 63.31,13.21 52.12,13.21 v50.24,15.09 49.74,15.09 49.72,15.11 45.3,15.11 34.67,4.49 33.99,4.49 33.02,3.51
SS  (via drill 0.35 pad 0.41)
  Top 0.254: v44.11,39.2 43.66,39.2 43.08,38.61 43.08,35.7 R25.2 44.33,34.32 44.33,33.34 44.9,32.78 U1.27
  Bottom 0.305: J1.11 36.53,50.8 36.53,46.8 44.11,39.22 v44.11,39.2
STATUS_LED_CTRL  (via drill 0.35)
  Top 0.127: IC3.F1 33,31.2 | 33,31.2 | v34,30.83 33.63,31.2 33,31.2
  Top 0.305: TR8.1 19.85,25.35 v20.21,25.7
  Bottom 0.203: v20.21,25.7 20.71,26.21 20.72,26.2 20.72,31.38 21.91,32.56 24.05,32.56 24.44,32.95 25.55,32.95 27.04,31.46 27.56,30.94 28.21,30.29 30.09,30.29 30.79,30.99 33.78,30.99 v34,30.83
SW  (via drill 0.35)
  Top 0.61: IC5.6 29.83,10.61 | v32.83,14.69 31.79,15.73 C17.2
  Bottom 0.61: v32.83,14.69 v32.84,14.69 34.85,12.67 v34.85,10.54
  pour Top: 23.98,11.3 35.12,11.3 35.12,12.19 39.5,12.19 40.13,11.56 40.13,9.02 39.07,7.9 23.98,7.9
TARGET_RESET_EDBG  (via drill 0.35)
  Top 0.127: IC3.B4 30.23,28.27 32.17,28.27
  Top 0.152: 32.17,28.27 32.7,27.75 v32.7,27.04
  Top 0.203: R4.1 48.01,20.81 C8.1 47.77,21.16 47.77,24.96 48.74,25.92 v48.74,26.69 U1.40
  Bottom 0.254: v32.7,27.04 v32.7,27.05 33.62,27.98 47.45,27.98 v48.73,26.69 v48.74,26.69
TARGET_RESET_SENSE  (via drill 0.35)
  Top 0.127: 31.23,32.5 31.55,32.82 32.56,32.82
  Top 0.152: IC3.H2 31.23,32.5 | 32.56,32.82 v32.66,32.72
  Top 0.406: v22.87,7.77 22.19,7.09 R38.1
  Route15 0.305: v32.66,32.72 32.66,32.03 31.37,30.73 31.37,16.26 v22.87,7.77
TARGET_USB_N  (via drill 0.35)
  Top 0.152: J4.2 4.58,38.72 4.58,38.64
  Top 0.203: 7.15,38.64 14.49,38.64 arc34 16.9,39.39 arc-31 18.89,40.05 32.75,40.05 arc-92 35.5,37.18 35.5,33.24 arc90 38.56,29.74 46.41,29.74 U1.33 | 7.15,38.64 4.58,38.64 | Z6.1 7.37,39.79 7.15,39.77 7.15,38.64
  Top 0.305: v7.35,40.65 7.37,40.63 7.37,39.79
  Bottom 0.305: D-.X 7.35,40.55 v7.35,40.65
TARGET_USB_P  (via drill 0.35)
  Top 0.152: J4.3 4.6,38.15 4.6,38.22
  Top 0.203: 7.15,38.22 14.62,38.22 arc36 17.23,39.06 arc-30 18.82,39.68 32.7,39.68 arc-90 35.03,36.98 35.03,32.93 arc90 38.81,29.33 46.4,29.33 U1.34 | 4.6,38.22 7.15,38.22 | Z5.1 7.15,37.11 7.15,38.22
  Top 0.305: Z5.1 7.4,36.05 7.45,36 v7.5,36.05
  Bottom 0.305: v7.5,36.05 7.5,38.37 D+.X
USBVCC  (via drill 0.35)
  Top 0.305: TR1.1 33.36,37.62 v33,37.62
  Top 0.406: v27.12,45.95 18.94,45.95 16.32,43.34 16.25,43.26
  Top 0.61: F2.1 11.63,43.27 C6.1 C7.1 16.25,43.26 | R14.2 16.32,43.34 | 16.32,43.34
  Bottom 0.305: v33,37.62 27.12,43.5 v27.12,45.95
VCC_EDBG_3V3  (via drill 0.21 pad 0.41, 0.35, 0.35 pad 0.61)
  Top 0.127: IC3.F6 v28.93,31.52 | IC3.E5 v29.57,30.88 | IC3.B6 IC3.B5 29.57,28.27 29.57,27.5 v30.23,26.84 | IC3.F2 31.52,30.88 32.3,30.88 32.5,30.68 33.23,30.68 34.01,29.9 v34.19,29.7 | IC3.J5 28.93,33.48 28.93,34.45 28.33,35.04 28.33,36.29 27.35,37.27 C31.1
  Top 0.152: IC3.D10 25.74,29.9 25.48,30.09 24.31,30.09 v24.23,30.01
  Top 0.203: IC3.D9 IC3.D10 | C36.1 22.09,30.41 23.45,30.41 C34.1 23.77,30.43 v24.23,30.01
  Top 0.254: C29.1 30.75,26.32 v30.23,26.84 | C30.1 C32.1 | L2.1 27.05,38.28 v26.8,38.28
  Top 0.305: C30.1 v34.19,29.7 | C33.1 30.66,25.8 C29.1 | R33.2 R32.2 16.3,28.36 16.84,27.82 v17.28,27.82 | L2.1 27.46,37.32 C31.1
  Top 0.813: R21.2 35.8,25.12 v35.63,25.15
  pour Route2 (isolate 0.254): 17.02,39.88 17.03,39.88 17.03,45.7 26.39,45.7 26.39,39.91 36.01,39.88 36.01,19.05 17.02,19.05
VCC_EDBG_USB  (via drill 0.35)
  Top 0.152: IC3.A10 25.35,27.95
  Top 0.203: 25.35,27.95 24.5,27.95
  Top 0.305: 21.91,25.01 21.91,26.2 22.95,27.23 23.79,27.23 24.5,27.95
  Top 0.406: 21.91,25.01 21.07,24.18 13.27,24.18 C28.1 13.13,24.81 12.75,25.2 8.38,25.2 6.91,26.66 v6.91,27.79
  Top 0.61: F3.1 5.67,29.73 6.91,28.49 v6.91,27.79 | v12.14,17.13 14.79,17.13 TR2.1
  Bottom 0.61: v6.91,27.79 5.36,26.24 5.36,17.92 6.15,17.13 v12.14,17.13
VDDCORE
  Top 0.203: 50.24,25.6 U1.43
  Top 0.254: 50.24,25.6 49.53,24.89 49.53,23.39 C19.1
VIN_SW
  Top 0.254: R3.1 19.51,7.21 C2.+
  Top 0.61: 21.71,11.52 17.32,11.52 D1.C 14.27,11.91 11.91,14.27 11.92,14.28 R16.2 | 21.71,11.52 23.44,11.52 25.17,13.25 26.11,13.25 R5.1 28.42,13.23 28.88,12.77 IC5.5 | C2.+ 21.71,11.52
XUSB  (via drill 0.35)
  Top 0.406: F2.2 6.15,41.69 v6.15,40.9 6.15,40.21 5.34,39.4 J4.1
  Top 0.61: C26.1 5.19,44.8 6.95,43.04 F2.2
  Route2 0.305: v8.65,35.95 8.65,35.6 8.15,35.1 6.55,35.1 4.85,36.8 4.85,39.55 6.2,40.9 v6.15,40.9
  Bottom 0.305: U5V2.X 8.53,36.12 8.65,36 v8.65,35.95
XVCC  (via drill 0.35)
  Top 0.254: J5.1 4.57,23.55 5.09,23.55
  Top 0.305: v6.12,24.53 5.75,24.53 5.67,24.6
  Top 0.406: 5.09,23.55 5.67,24.14 5.67,24.6 5.67,26.58 2.52,29.73 F3.2
  Route2 0.305: v9.3,20.14 5.8,23.64 5.8,24.21 v6.12,24.53
  Bottom 0.305: U5V1.X 9.11,20.15 9.3,20.15 v9.3,20.14

## Text on the board
Bottom: ZERO_V4.0
tPlace: 13 | 12 | 11 | 10 | 9 | 8 | 7 | 6 | 5 | 4 | 3 | 2 | 1 | 0
tNames: SCL | SDA | AREF | GND | # | # | # | # | # | # | DIGITAL | [#=PWM] | TX | RX | 1 | ANALOG IN | IOREF | RESET | 3V3 | 5V | GND | VIN | A0 | A1 | A2 | A3 | A4 | A5
bNames: designed by | MADE IN | tinker it | ITALY
ReferenceLC: ON
214bmp: D:/SmartProjects/Snc/a4_bn_logo2.bmp